# EAGLE design class-d-amp-single-supply (EAGLE 5.10)
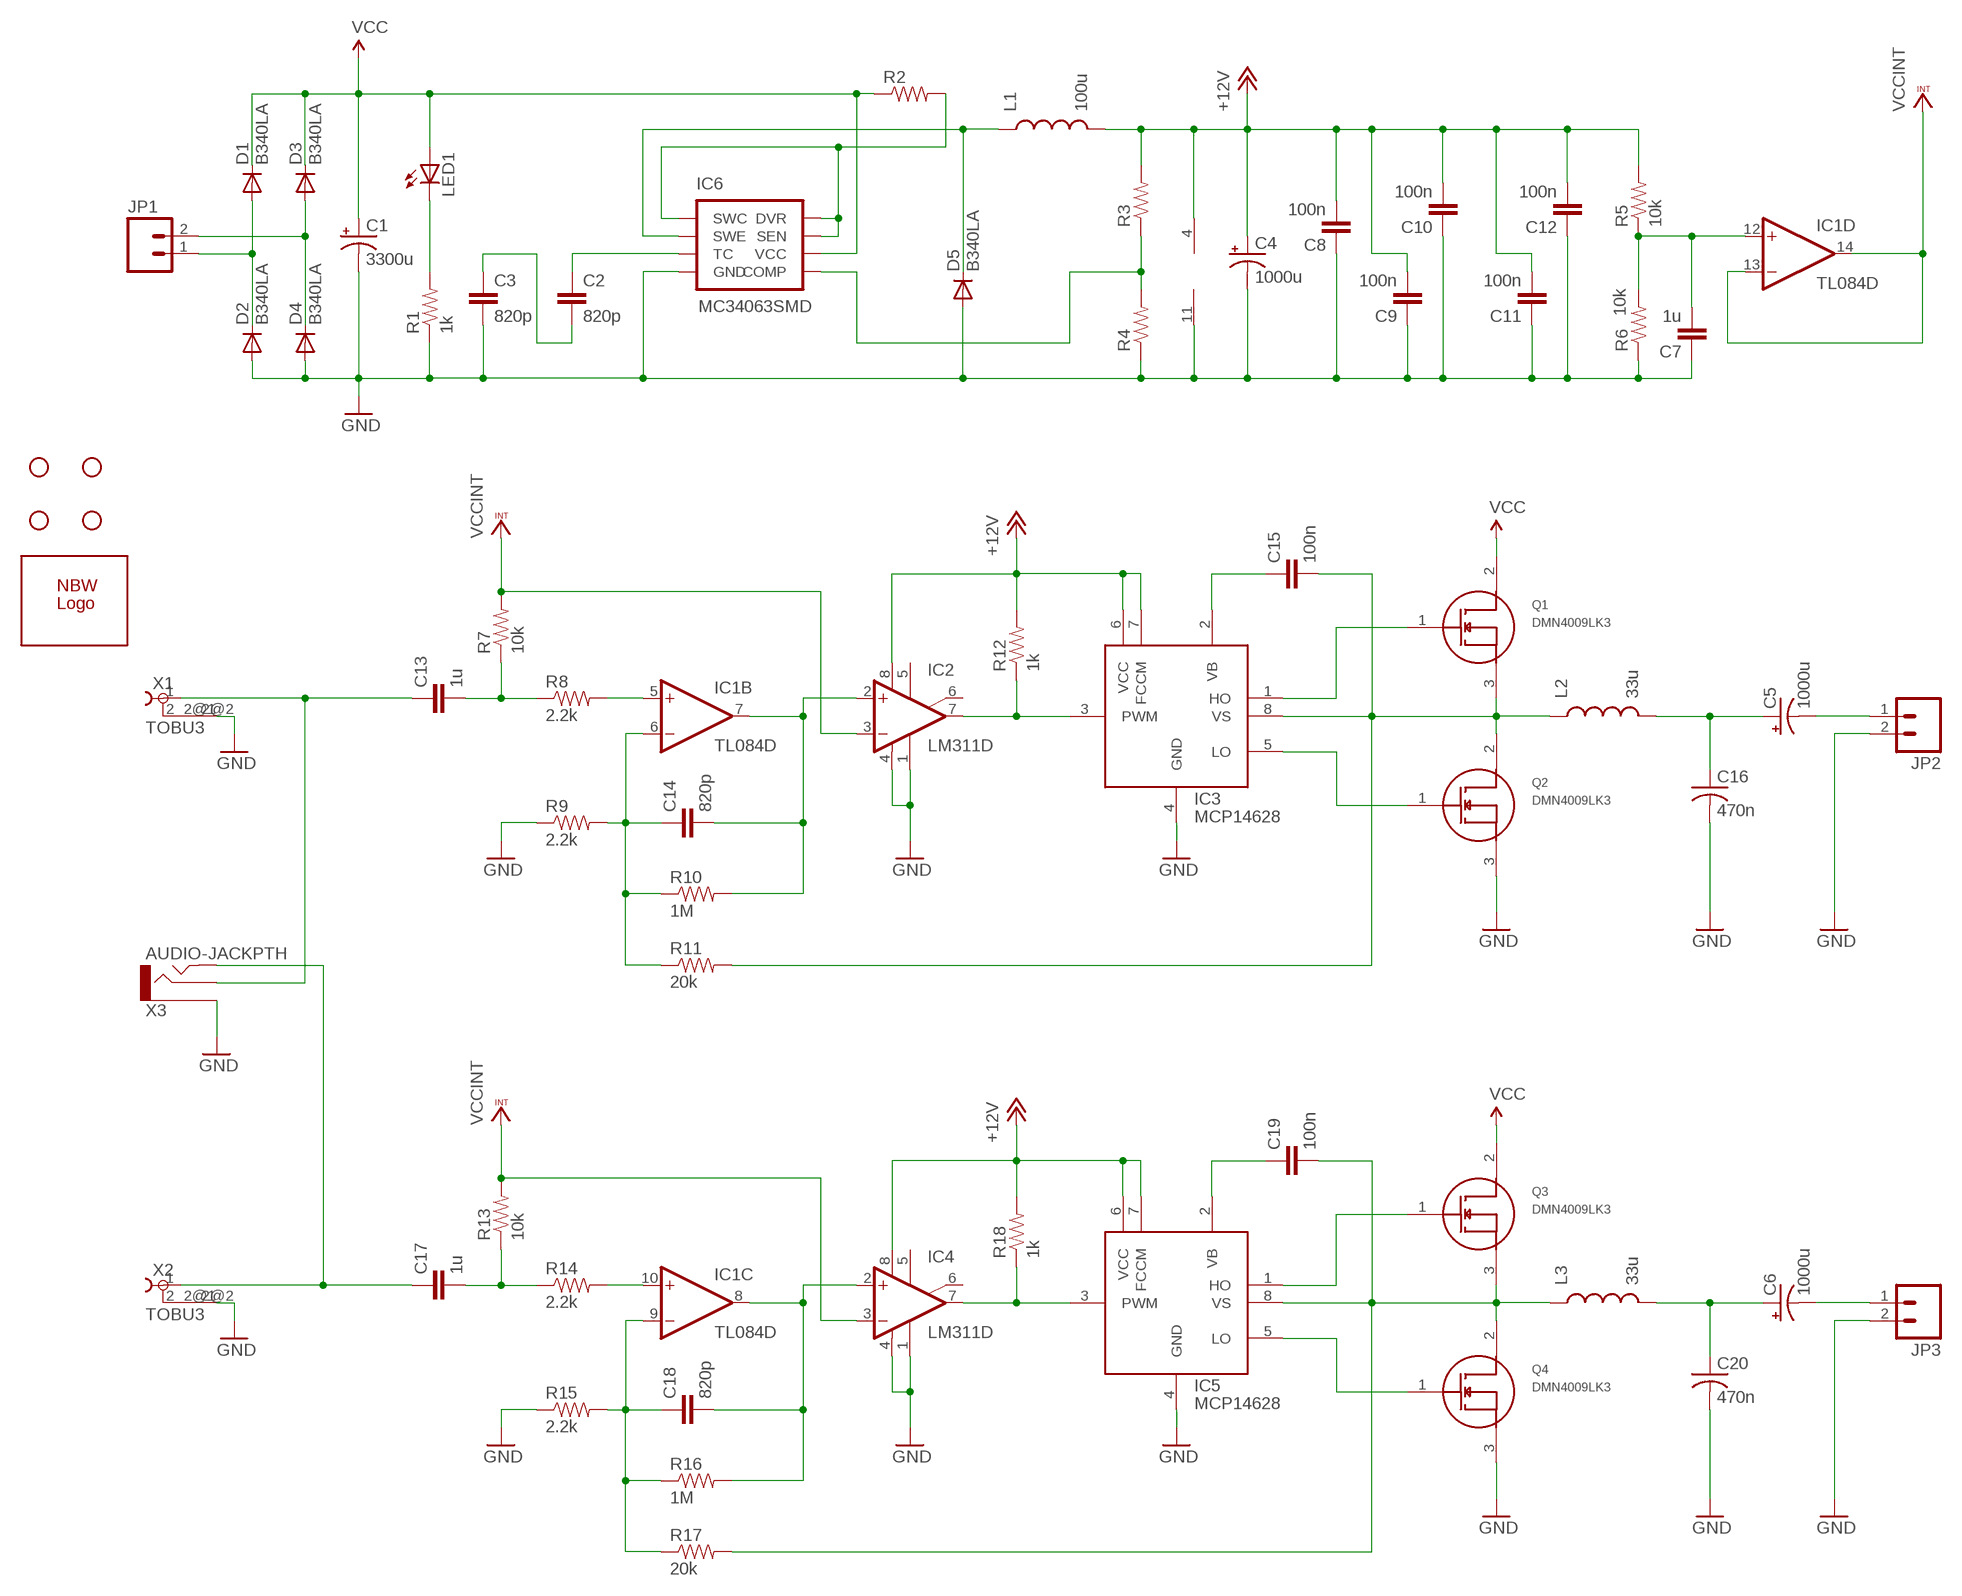
[diagram p0: schematic, sheet 1]

## Parts
C1  3300u  CPOL-USE7.5-18  [E7,5-18]
C2  820p  CAP0603  [0603]
C3  820p  CAP0603  [0603]
C4  1000u  CPOL-USE7.5-16  [E7,5-16]
C5  1000u  CPOL-USE7.5-16  [E7,5-16]
C6  1000u  CPOL-USE7.5-16  [E7,5-16]
C7  1u  CAP0603  [0603]
C8  100n  CAP0603  [0603]
C9  100n  CAP0603  [0603]
C10  100n  CAP0603  [0603]
C11  100n  CAP0603  [0603]
C12  100n  CAP0603  [0603]
C13  1u  CAP0603  [0603]
C14  820p  CAP0603  [0603]
C15  100n  CAP0603  [0603]
C16  470n  C-USC1210  [C1210]
C17  1u  CAP0603  [0603]
C18  820p  CAP0603  [0603]
C19  100n  CAP0603  [0603]
C20  470n  C-USC1210  [C1210]
D1  B340LA  DIODESMA  [SMA-DIODE]
D2  B340LA  DIODESMA  [SMA-DIODE]
D3  B340LA  DIODESMA  [SMA-DIODE]
D4  B340LA  DIODESMA  [SMA-DIODE]
D5  B340LA  DIODESMA  [SMA-DIODE]
IC1  TL084D  [SO14]
IC2  LM311D  [SO08]
IC3  MCP14628  [SO-08]
IC4  LM311D  [SO08]
IC5  MCP14628  [SO-08]
IC6  MC34063SMD  [SO08]
JP1  M02PTH  [1X02]
JP2  M02PTH  [1X02]
JP3  M02PTH  [1X02]
L1  100u  INDUCTORCR54  [CR54]
L2  33u  INDUCTORPWR  [CDRH125]
L3  33u  INDUCTORPWR  [CDRH125]
LED1  LED5MM  [LED5MM]
Q1  DMN4009LK3  [TO252-3L]
Q2  DMN4009LK3  [TO252-3L]
Q3  DMN4009LK3  [TO252-3L]
Q4  DMN4009LK3  [TO252-3L]
R1  1k  RESISTOR0603  [0603]
R2  RESISTOR1206  [1206]
R3  RESISTOR0603  [0603]
R4  RESISTOR0603  [0603]
R5  10k  RESISTOR0603  [0603]
R6  10k  RESISTOR0603  [0603]
R7  10k  RESISTOR0603  [0603]
R8  2.2k  RESISTOR0603  [0603]
R9  2.2k  RESISTOR0603  [0603]
R10  1M  RESISTOR0603  [0603]
R11  20k  RESISTOR0603  [0603]
R12  1k  RESISTOR0603  [0603]
R13  10k  RESISTOR0603  [0603]
R14  2.2k  RESISTOR0603  [0603]
R15  2.2k  RESISTOR0603  [0603]
R16  1M  RESISTOR0603  [0603]
R17  20k  RESISTOR0603  [0603]
R18  1k  RESISTOR0603  [0603]
U$1  STAND-OFF  [STAND-OFF]
U$2  STAND-OFF  [STAND-OFF]
U$3  STAND-OFF  [STAND-OFF]
U$4  STAND-OFF  [STAND-OFF]
U$5  NBW_LOGOMED  [NBW_LOGO2]
X1  TOBU3  [TOBU3]
X2  TOBU3  [TOBU3]
X3  AUDIO-JACKPTH  [AUDIO-JACK]

## Nets
+12V: C4.+ C8.2 C9.2 C10.2 C11.2 C12.2 IC1.4(P:V+) IC2.8(V+) IC3.6(VCC) IC3.7(FCCM) IC4.8(V+) IC5.6(VCC) IC5.7(FCCM) L1.P$2 R3.2 R5.2 R12.2 R18.2
GND: C1.- C3.2 C4.- C7.1 C8.1 C9.1 C10.1 C11.1 C12.1 C16.2 C20.2 D2.A D4.A D5.A IC1.11(P:V-) IC2.1(GND) IC2.4(V-) IC3.4(GND) IC4.1(GND) IC4.4(V-) IC5.4(GND) IC6.4(GND) JP2.2 JP3.2 Q2.3 Q4.3 R1.1 R4.1 R6.1 R9.1 R15.1 X1.2@2 X2.2@2 X3.1
N$1: D1.A D2.C JP1.1
N$2: D3.A D4.C JP1.2
N$3: C2.1 IC6.3(TC)
N$4: C2.2 C3.1
N$5: IC6.1(SWC) IC6.7(SEN) IC6.8(DVR) R2.2
N$6: C17.2 R13.1 R14.1
N$7: LED1.K(C) R1.2
N$8: IC6.5(COMP) R3.1 R4.2
N$9: D5.C IC6.2(SWE) L1.P$1
N$10: C7.2 IC1.12(D:+IN) R5.1 R6.2
N$11: C13.2 R7.1 R8.1
N$12: C14.1 IC1.6(B:-IN) R9.2 R10.1 R11.1
N$13: IC1.5(B:+IN) R8.2
N$14: C14.2 IC1.7(B:OUT) IC2.2(+IN) R10.2
N$15: IC2.7(OUT) IC3.3(PWM) R12.1
N$16: C18.1 IC1.9(C:-IN) R15.2 R16.1 R17.1
N$17: C15.1 IC3.2(VB)
N$18: C15.2 IC3.8(VS) L2.1 Q1.3 Q2.2 R11.2
N$19: IC3.1(HO) Q1.1
N$20: IC3.5(LO) Q2.1
N$21: C5.+ C16.1 L2.2
N$22: C5.- JP2.1
N$23: IC1.10(C:+IN) R14.2
N$24: C18.2 IC1.8(C:OUT) IC4.2(+IN) R16.2
N$25: IC4.7(OUT) IC5.3(PWM) R18.1
N$26: C19.1 IC5.2(VB)
N$27: C19.2 IC5.8(VS) L3.1 Q3.3 Q4.2 R17.2
N$28: IC5.1(HO) Q3.1
N$29: IC5.5(LO) Q4.1
N$30: C6.+ C20.1 L3.2
N$31: C6.- JP3.1
N$33: C17.1 X2.1 X3.5
N$34: C13.1 X1.1 X3.2
VCC: C1.+ D1.C D3.C IC6.6(VCC) LED1.A Q1.2 Q3.2 R2.1
VCCINT: IC1.13(D:-IN) IC1.14(D:OUT) IC2.3(-IN) IC4.3(-IN) R7.2 R13.2
Unconnected: IC1.1(A:OUT) IC1.2(A:-IN) IC1.3(A:+IN) IC2.5(ON) IC2.6(ON/STR) IC4.5(ON) IC4.6(ON/STR) X1.2 X1.2@1 X2.2 X2.2@1

## Library data of the parts
C1 C4-C6 = rcl:CPOL-US: POLARIZED CAPACITOR, American symbol
C2 C3 C7-C15 C17-C19 = SparkFun:CAP: Capacitor Standard 0603 ceramic capacitor, and 0.1" leaded capacitor.
C16 C20 = rcl:C-US: CAPACITOR, American symbol
D1-D5 = SparkFun:DIODE: Diode These are standard reverse protection diodes and small signal diodes. SMA package can handle up to about 1A. SOD-323 can handle about 200mA. What the SOD-323 package when ordering, there are some mfgs out there that are 5-pin packages.
IC1 = linear:TL084: OP AMP
IC2 IC4 = linear:LM311: COMPARATOR
IC3 IC5 = Custom:MCP14628
IC6 = SparkFun:MC34063
JP1-JP3 = SparkFun:M02: Header 2 Standard 2-pin 0.1" header. Use with straight break away headers (SKU : PRT-00116), right angle break away headers (PRT-00553), swiss pins (PRT-00743), machine pins (PRT-00117), and female headers (PRT-00115). Molex polarized connector foot print use with SKU : PRT-08233 with associated crimp pins and housings.
L1-L3 = SparkFun:INDUCTOR: Inductors Basic Inductor/Choke - 0603 and 1206. Footprints are not proven and vary greatly between part numbers.
LED1 = SparkFun:LED: LEDs Standard schematic elements and footprints for 5mm, 3mm, 1206, and 0603 sized LEDs. 5mm - Spark Fun Electronics SKU : COM-00529 (and others)
Q1-Q4 = NBitWonder:DMN4009LK3
R1-R18 = SparkFun:RESISTOR: Resistor Basic schematic elements and footprints for 0603, 1206, and PTH 1/10th watt (small) resistors.
U$1-U$4 = SparkFun:STAND-OFF: Stand Off This is the mechanical footprint for a #4 phillips button head screw. Use the keepout ring to avoid running the screw head into surrounding components. SKU : PRT-00447
U$5 = NBitWonder:NBW_LOGO
X1 X2 = con-hirschmann:TOBU3: Female Cinch CONNECTOR ( RCA Jack )
X3 = SparkFun:AUDIO-JACK: 3.5mm Audio Jack Simple 3.5mm common PCB mount audio jack. SKU: PRT-08032

## Board
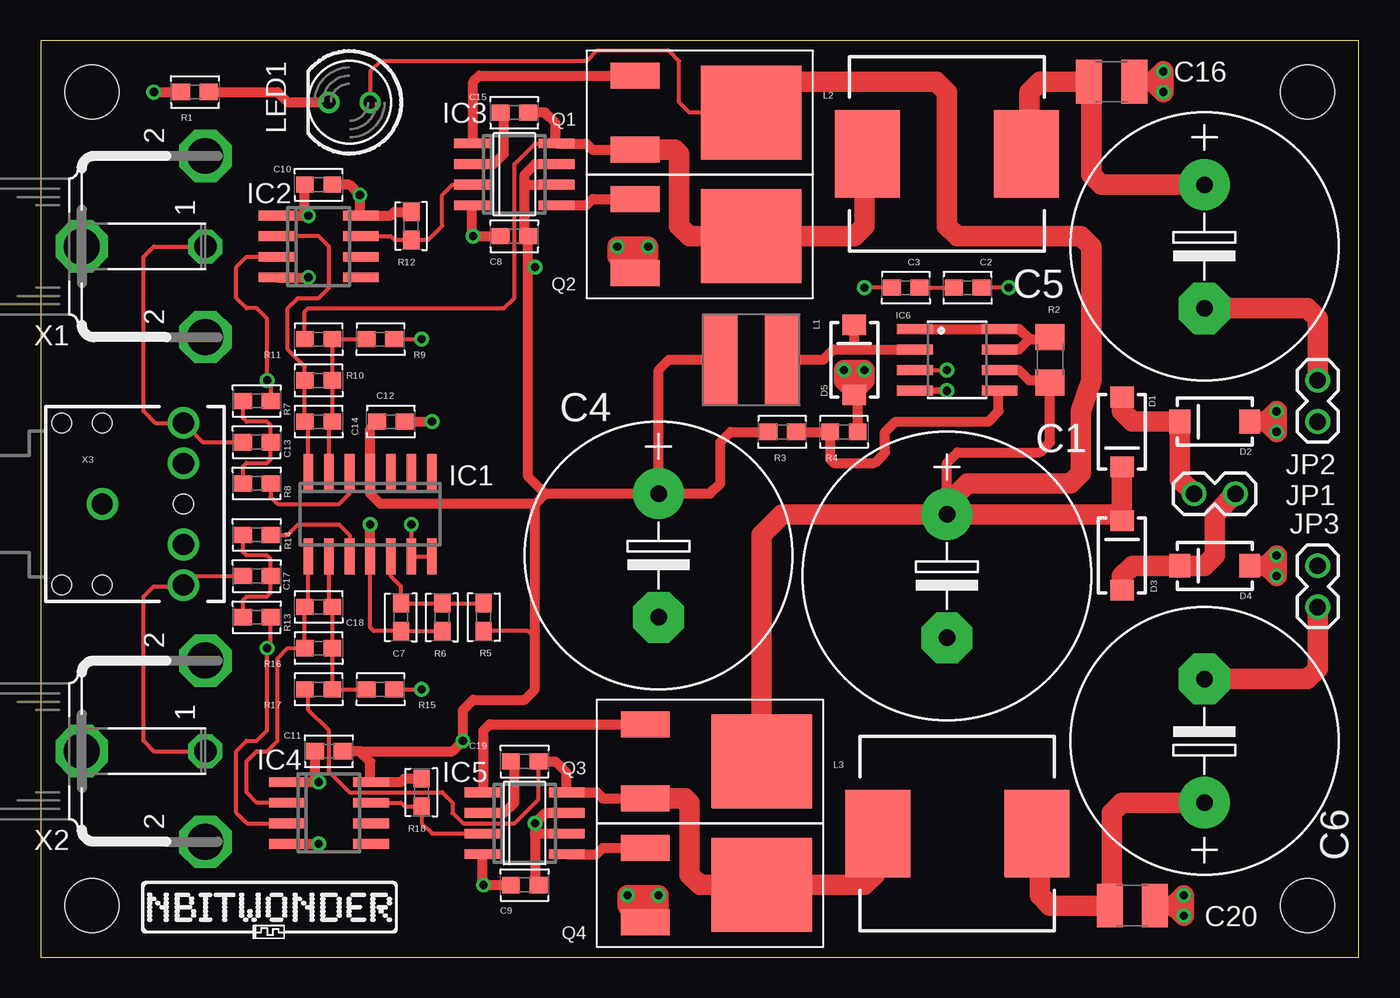
[diagram p1: board, top side]
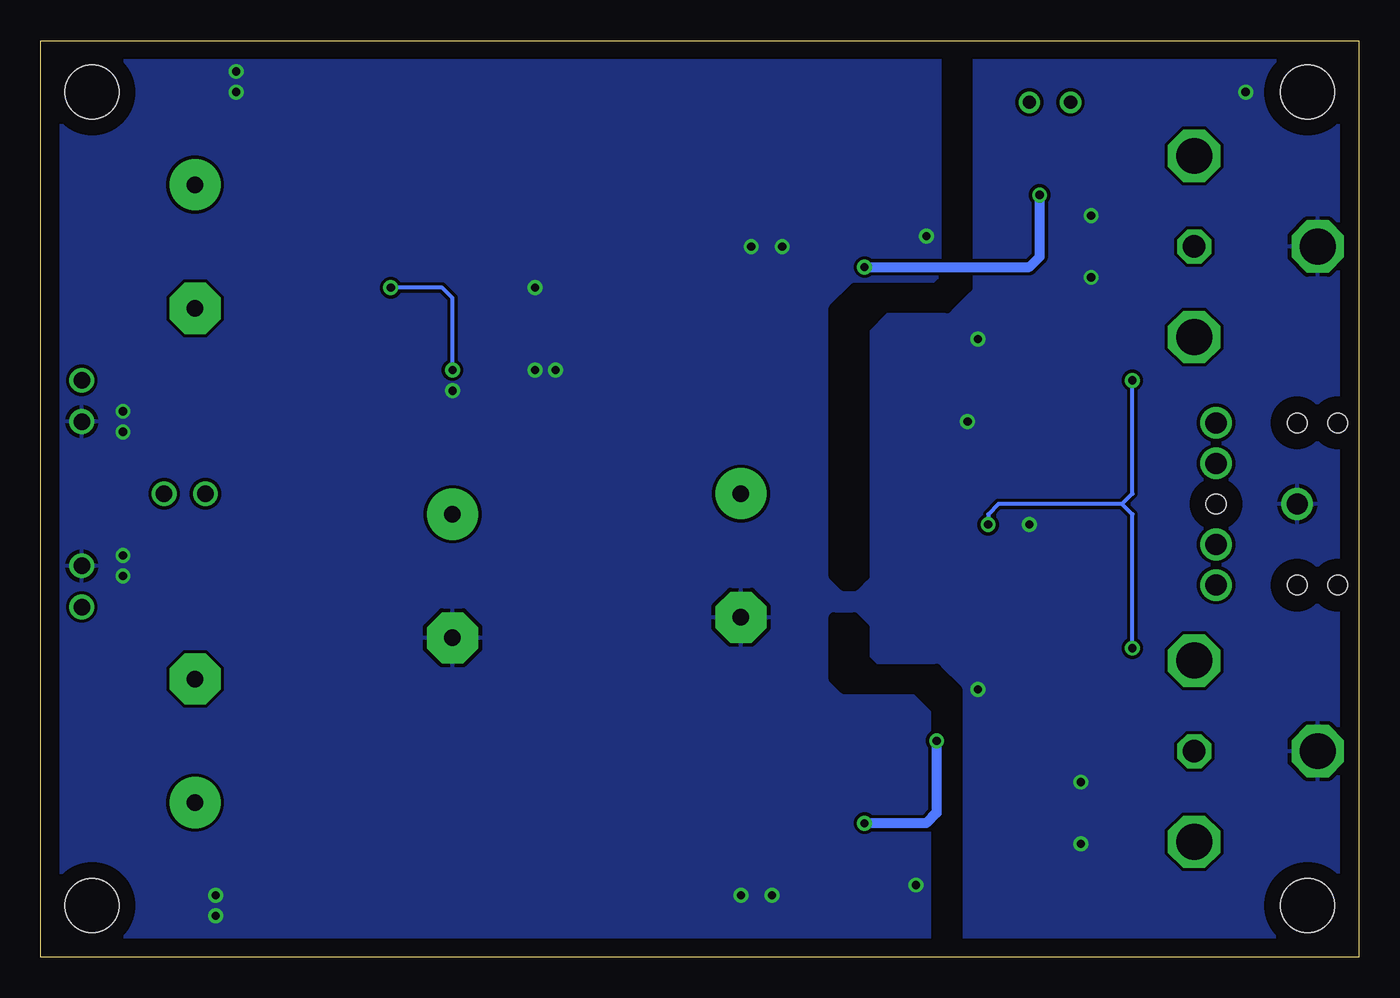
[diagram p2: board, bottom side, seen from below]

Size 81.28 x 56.52 mm. Coordinates in mm from the lower left corner, seen from the top.
Outline: 0,0 81.28,0 81.28,56.52 0,56.52 0,0
Copper layers (1*16): Top 0.035mm / dielectric 1.5mm / Bottom 0.035mm
Design rules "default *": minimum track width 10mil, minimum drill 24mil, track to track 8mil, track to pad 8mil, pad to pad 8mil, via to via 8mil, smd to smd 8mil, copper to edge 40mil, drill to drill 8mil, minimum pad ring 10mil, minimum via ring 8mil, stop-mask expansion 4mil, vias tented up to drill 20mil, thermal gap 10mil
bRestrict: area 24.1,22.9 to 32.4,55.2; area 24.8,1.3 to 32.4,21

### Footprints (pad centres in the part's own frame; a part is rotated, then mirrored left to right if it is on the bottom)
E7,5-18 = drill 1.016 pad 3.15 round: + -3.81,0 | drill 1.016 pad 3.15 octagon: - 3.81,0
0603 = smd 1.1 x 1: 1 -0.85,0; 2 0.85,0
E7,5-16 = drill 1.016 pad 3.15 round: + -3.81,0 | drill 1.016 pad 3.15 octagon: - 3.81,0
C1210 = smd 1.6 x 2.7: 1 -1.4,0; 2 1.4,0
SMA-DIODE = smd 1.27 x 1.47: A -2.15,0; C 2.15,0
SO14 = smd 0.6 x 2.2: 1 -3.81,-2.6; 2 -2.54,-2.6; 3 -1.27,-2.6; 4 0,-2.6; 5 1.27,-2.6; 6 2.54,-2.6; 7 3.81,-2.6; 8 3.81,2.6; 9 2.54,2.6; 10 1.27,2.6; 11 0,2.6; 12 -1.27,2.6; 13 -2.54,2.6; 14 -3.81,2.6
SO08 = smd 0.6 x 2.2: 1 -1.905,-2.6; 2 -0.635,-2.6; 3 0.635,-2.6; 4 1.905,-2.6; 5 1.905,2.6; 6 0.635,2.6; 7 -0.635,2.6; 8 -1.905,2.6
SO-08 = smd 0.6 x 2.2: 1 -1.905,-2.6; 2 -0.635,-2.6; 3 0.635,-2.6; 4 1.905,-2.6; 5 1.905,2.6; 6 0.635,2.6; 7 -0.635,2.6; 8 -1.905,2.6
SO08' = smd 0.61 x 2.21: 1 -1.905,-2.616; 2 -0.635,-2.616; 3 0.635,-2.616; 4 1.905,-2.616; 5 1.905,2.616; 6 0.635,2.616; 7 -0.635,2.616; 8 -1.905,2.616
1X02 = drill 1.016 round: 1 0,0; 2 2.54,0
CR54 = smd 5.5 x 2.15: P$1 0,1.92; P$2 0,-1.92
CDRH125 = smd 5.4 x 4: 1 0,4.9; 2 0,-4.9
LED5MM = drill 0.813 round: A -1.27,0; K 1.27,0
TO252-3L = smd 2.997 x 1.6: 1 7.163,-2.286; 3 7.163,2.286 | smd 6.198 x 5.791: 2 0,0
1206 = smd 1.6 x 1.8: 1 -1.4,0; 2 1.4,0
STAND-OFF = hole 3.302: 0,0
TOBU3 = drill 1.397 octagon: 1 0,-2.54 | drill 2.21 octagon: 2 5.588,-2.54; 2@1 -5.588,-2.54; 2@2 0,5.08
AUDIO-JACK = drill 1.3 round: 1 0,0; 2 5,5; 3 5,2.5; 4 5,-2.5; 5 5,-5 | hole 1.2: 0,5; -2.5,5; -2.5,-5; 0,-5; 5,0

### Placement (x,y rotation side)
C1  55.88,23.5 270 top
C2  57.15,41.27 180 top
C3  53.34,41.27 180 top
C4  38.1,24.77 270 top
C5  71.75,43.81 270 top
C6  71.75,13.34 90 top
C7  22.23,20.95 90 top
C8  29.21,44.45 0 top
C9  29.84,4.45 0 top
C10  17.14,47.62 0 top
C11  17.78,12.7 0 top
C12  21.59,33.02 180 top
C13  13.34,31.75 0 top
C14  17.14,33.02 180 top
C15  29.21,52.07 0 top
C16  66.04,53.98 0 top
C17  13.34,23.5 0 top
C18  17.14,21.59 180 top
C19  29.84,12.06 0 top
C20  67.31,3.17 0 top
D1  66.67,32.38 270 top
D2  72.39,33.02 180 top
D3  66.67,24.77 90 top
D4  72.39,24.13 180 top
D5  50.16,36.83 90 top
IC1  20.32,27.3 180 top
IC2  17.14,43.81 270 top
IC3  29.21,48.26 270 top
IC4  17.78,8.89 270 top
IC5  29.84,8.26 270 top
IC6  MC34063SMD  [SO08']  56.52,36.83 270 top
JP1  71.12,28.57 0 top
JP2  78.74,35.56 270 top
JP3  78.74,21.59 90 top
L1  43.81,36.83 270 top
L2  55.88,49.53 90 top
L3  56.52,7.62 90 top
LED1  19.05,52.7 180 top
Q1  43.81,52.07 180 top
Q2  43.81,44.45 180 top
Q3  44.45,12.06 180 top
Q4  44.45,4.45 180 top
R1  9.53,53.34 0 top
R2  62.23,36.83 90 top
R3  45.72,32.38 180 top
R4  49.53,32.38 180 top
R5  27.3,20.95 270 top
R6  24.77,20.95 90 top
R7  13.34,34.29 0 top
R8  13.34,29.21 0 top
R9  20.95,38.1 180 top
R10  17.14,35.56 180 top
R11  17.14,38.1 180 top
R12  22.86,45.09 90 top
R13  13.34,20.95 0 top
R14  13.34,26.04 0 top
R15  20.95,16.51 180 top
R16  17.14,19.05 180 top
R17  17.14,16.51 180 top
R18  23.5,10.16 90 top
U$1  78.11,53.34 0 top
U$2  3.17,53.34 0 top
U$3  78.11,3.17 0 top
U$4  3.17,3.17 0 top
U$5  5.71,0.64 0 top
X1  7.62,43.81 90 top
X2  7.62,12.7 90 top
X3  3.81,27.94 0 top

### Tracks (layer width: path | path; a pad name or v marks a point on that pad's centre or on a via)
+12V  (via drill 0.51)
  Top 0.254: R5.2 30.06,20.11 30.48,19.68
  Top 0.61: IC3.7 30.48,48.9 29.84,48.26 29.84,47.62 | 29.84,47.62 29.84,44.66 C8.2 30.06,42.55 | 29.84,47.62 IC3.6 | IC5.7 31.11,8.89 v30.48,8.26 30.48,7.62 | 30.48,7.62 30.48,4.66 C9.2 | 30.48,7.62 IC5.6 | C10.2 19.05,47.62 v19.68,46.99 19.68,45.78 IC2.8 21.59,45.72 21.8,45.94 R12.2 | 19.68,12.7 C11.2 | 19.68,12.7 20.32,12.06 20.32,10.86 IC4.8 22.23,10.79 22.44,11.01 R18.2 | C12.2 20.32,32.6 IC1.4 20.32,28.57 20.95,27.94 30.48,27.94 | L1.P$2 38.73,36.83 38.1,36.2 C4.+ | R3.2 42.55,32.38 41.91,31.75 41.91,29.21 41.27,28.57 C4.+ | 30.06,42.55 30.06,29.63 31.11,28.57 | 31.11,28.57 C4.+ | 30.48,27.94 31.11,28.57 | 30.48,27.94 30.48,19.68 30.48,16.51 29.84,15.88 26.67,15.88 26.04,15.24 v26.04,13.34 25.4,12.7 19.68,12.7 | 30.06,42.55 v30.48,42.55
  Bottom 0.61: v30.48,42.55 20.32,42.55 19.68,43.18 v19.68,46.99 | v26.04,13.34 26.04,8.89 26.67,8.26 v30.48,8.26
GND  (via drill 0.51)
  Top 0.254: IC1.11 20.32,20.32 20.54,20.11 C7.1 R6.1 | R9.1 v23.5,38.1 | R15.1 v23.5,16.51 | C3.2 v50.8,41.27
  Top 0.406: IC6.4 v55.88,34.92
  Top 0.61: IC1.11 v20.32,26.67 | C9.1 v27.3,4.45 27.25,4.5 IC5.4 | C8.1 v26.67,44.45 26.61,44.51 IC3.4 | v6.99,53.34 R1.1 | C12.1 v24.13,33.02 | R4.1 50.38,34.47 D5.A | IC2.1 v16.51,45.72 16.3,45.94 C10.1 | IC2.4 v16.51,41.91 | IC4.1 v17.14,10.79 16.93,11.01 C11.1 | IC4.4 v17.14,6.99
  Top 1.27: 75.56,33.02 v76.2,33.66 v76.2,32.38 75.56,33.02 | D2.A 75.56,33.02 | 75.56,24.13 v76.2,24.77 v76.2,23.5 75.56,24.13 | D4.A 75.56,24.13 | 69.85,3.17 v70.48,3.81 v70.48,2.54 69.85,3.17 | C20.2 69.85,3.17 | 68.58,53.98 v69.22,54.61 v69.22,53.34 68.58,53.98 | C16.2 68.58,53.98 | v50.8,36.2 v49.53,36.2 49.53,35.56 50.16,34.92 50.8,35.56 v50.8,36.2 | v50.8,36.2 50.16,35.56 D5.A | v37.47,43.81 37.47,42.55 36.2,42.55 35.56,43.18 v35.56,43.81 v37.47,43.81 | v37.47,43.81 37.47,42.98 Q2.3 | v38.1,3.81 38.1,2.54 36.83,2.54 36.2,3.17 v36.2,3.81 v38.1,3.81 | v38.1,3.81 37.47,3.17 37.47,2.34 Q4.3
  pour Bottom: 1.27,55.24 80.01,55.24 80.01,1.27 1.27,1.27
N$1
  Top 1.27: JP1.1 70.24,29.45 D2.C 67.31,33.02 66.67,33.66 D1.A
N$2
  Top 1.27: JP1.2 72.39,27.3 72.39,24.77 71.75,24.13 D4.C 67.31,24.13 66.67,23.5 D3.A
N$3  (via drill 0.51)
  Top 0.254: IC6.3 v55.88,36.2 | v59.69,41.27 C2.1
  Bottom 0.254: v55.88,36.2 55.88,40.64 56.52,41.27 v59.69,41.27
N$4
  Top 0.254: C3.1 C2.2
N$5
  Top 0.406: 62.1,38.1 R2.2
  Top 0.61: IC6.7 60.33,37.47 60.96,38.1 | 60.96,38.1 62.1,38.1 | 60.96,38.1 60.33,38.73 IC6.8 IC6.1
N$6
  Top 0.254: R14.1 12.48,24.98 12.7,24.77 13.97,24.77 14.19,24.55 C17.2 14.19,22.44 13.97,22.23 12.7,22.23 12.48,22.01 R13.1
N$7
  Top 0.61: LED1.K 15.24,52.7 14.61,53.34 R1.2
N$8
  Top 0.61: R3.1 R4.2 48.68,30.7 48.9,30.48 51.44,30.48 52.07,31.11 52.07,32.38 52.7,33.02 58.42,33.02 59.05,33.66 59.05,34.85 IC6.5
N$9
  Top 0.61: 50.16,37.47 48.9,37.47 48.26,36.83 L1.P$1 | 50.16,37.47 IC6.2 | 50.16,37.47 D5.C
N$10
  Top 0.254: IC1.12 21.59,23.5 22.23,22.86 C7.2 R6.2 R5.1
N$11
  Top 0.254: R7.1 12.48,33.23 12.7,33.02 13.97,33.02 14.19,32.8 C13.2 14.19,30.7 13.97,30.48 12.7,30.48 12.48,30.27 R8.1
N$12
  Top 0.254: IC1.6 17.78,32.8 C14.1 R10.1 R11.1 R9.2
N$13
  Top 0.254: IC1.5 19.05,28.57 18.41,27.94 14.61,27.94 14.19,28.36 R8.2
N$14
  Top 0.254: IC1.7 16.51,32.8 C14.2 R10.2 16.3,36.41 15.24,37.47 15.24,40.01 15.88,40.64 17.14,40.64 17.78,41.27 17.78,43.81 17.14,44.45 IC2.2
N$15
  Top 0.254: IC2.7 21.59,44.45 21.8,44.23 R12.1 23.91,44.23 24.77,45.09 24.77,46.99 25.4,47.62 IC3.3
N$16
  Top 0.254: IC1.9 17.78,21.8 C18.1 R16.1 R17.1 R15.2
N$17
  Top 0.61: IC3.2 27.94,48.9 28.57,49.53 28.57,51.85 C15.1
N$18
  Top 0.254: R11.2 16.3,39.79 16.51,40.01 28.57,40.01 29.21,40.64 29.21,48.9 30.48,50.16 IC3.8
  Top 0.61: Q1.3 34.04,49.78 33.66,50.16 IC3.8 31.75,50.23 31.75,51.44 31.11,52.07 C15.2
  Top 1.27: Q1.3 39.12,49.78 39.37,49.53 39.37,45.09 40.01,44.45 Q2.2 50.16,44.45 50.8,45.09 50.8,49.35 L2.1
N$19
  Top 0.61: Q1.1 27.05,54.36 26.67,53.98 26.67,50.23 IC3.1
N$20
  Top 0.61: Q2.1 34.04,46.74 33.66,46.35 IC3.5
N$21
  Top 1.27: L2.2 60.96,49.71 60.96,53.34 61.59,53.98 C16.1 64.77,53.84 64.77,48.26 65.41,47.62 C5.+
N$22
  Top 1.27: JP2.1 78.74,39.37 78.11,40.01 C5.-
N$23
  Top 0.254: IC1.10 19.05,26.04 18.41,26.67 15.88,26.67 15.24,26.04 R14.2
N$24
  Top 0.254: IC1.8 16.51,21.8 C18.2 R16.2 15.24,19.05 14.61,18.41 14.61,13.34 13.97,12.7 13.34,12.7 12.7,12.06 12.7,10.16 13.34,9.53 IC4.2
N$25
  Top 0.254: IC4.7 22.23,9.53 22.44,9.31 R18.1 23.5,8.26 24.13,7.62 IC5.3
N$26
  Top 0.61: IC5.2 28.57,8.89 29.21,9.53 29.21,11.85 C19.1
N$27
  Top 0.254: C19.2 30.7,9.74 29.21,8.26 26.04,8.26 25.4,8.89 25.4,9.53 24.77,10.16 19.05,10.16 17.78,11.43 17.78,13.97 16.51,15.24 16.51,16.3 R17.2
  Top 0.61: Q3.3 34.67,9.78 34.29,10.16 IC5.8 32.38,10.22 32.38,11.43 31.75,12.06 C19.2
  Top 1.27: Q3.3 39.75,9.78 40.01,9.53 40.01,5.08 40.64,4.45 Q4.2 50.8,4.45 51.44,5.08 51.44,7.44 L3.1
N$28
  Top 0.61: Q3.1 27.69,14.35 27.3,13.97 27.3,10.22 IC5.1
N$29
  Top 0.61: Q4.1 34.67,6.73 34.29,6.35 IC5.5
N$30
  Top 1.27: L3.2 61.59,7.44 61.59,3.81 62.23,3.17 C20.1 66.04,3.31 66.04,8.89 66.67,9.53 C6.+
N$31
  Top 1.27: C6.- 78.11,17.14 78.74,17.78 JP3.1
N$33
  Top 0.254: X2.1 6.99,12.7 6.35,13.34 6.35,22.23 6.99,22.86 8.73,22.86 X3.5 9.37,23.5 C17.1
N$34
  Top 0.254: X1.1 6.99,43.81 6.35,43.18 6.35,33.66 7.07,32.94 X3.2 10,31.75 C13.1
VCC
  Top 0.254: LED1.A 20.32,54.61 20.95,55.24 33.66,55.24 34.29,55.88 38.73,55.88 39.37,55.24 39.37,52.7 40.01,52.07 Q1.2
  Top 0.406: R2.1 62.1,35.56
  Top 0.61: R2.1 62.23,31.75 61.59,31.11 56.52,31.11 55.88,30.48 55.88,27.94 C1.+ | IC6.6 60.33,36.2 60.96,35.56 62.1,35.56
  Top 1.27: D1.C D3.C 66.28,27.3 C1.+ 45.72,27.3 44.45,26.04 Q3.2 45.09,11.43 | Q1.2 44.45,52.07 46.35,53.98 55.24,53.98 55.88,53.34 55.88,45.09 56.52,44.45 64.14,44.45 64.77,43.81 64.77,35.56 64.14,33.66 64.14,29.84 63.5,29.21 57.15,29.21 55.88,27.94
VCCINT  (via drill 0.51)
  Top 0.254: IC4.3 12.7,8.26 12.06,8.89 12.06,12.7 12.7,13.34 13.34,13.34 13.97,13.97 v13.97,19.05 14.19,19.27 R13.2 | IC2.3 12.7,43.18 12.06,42.55 12.06,40.64 12.7,40.01 13.34,40.01 13.97,39.37 v13.97,35.56 14.19,35.34 R7.2 | IC1.14 IC1.13 v22.86,26.67
  Bottom 0.254: v22.86,26.67 22.86,27.3 22.23,27.94 14.61,27.94 | 14.61,27.94 13.97,28.57 v13.97,35.56 | 14.61,27.94 13.97,27.3 v13.97,19.05